# Altium schematic sheet STMwithBut&Leds.SchDoc
size A4; SheetNumber: 1; SheetTotal: 1
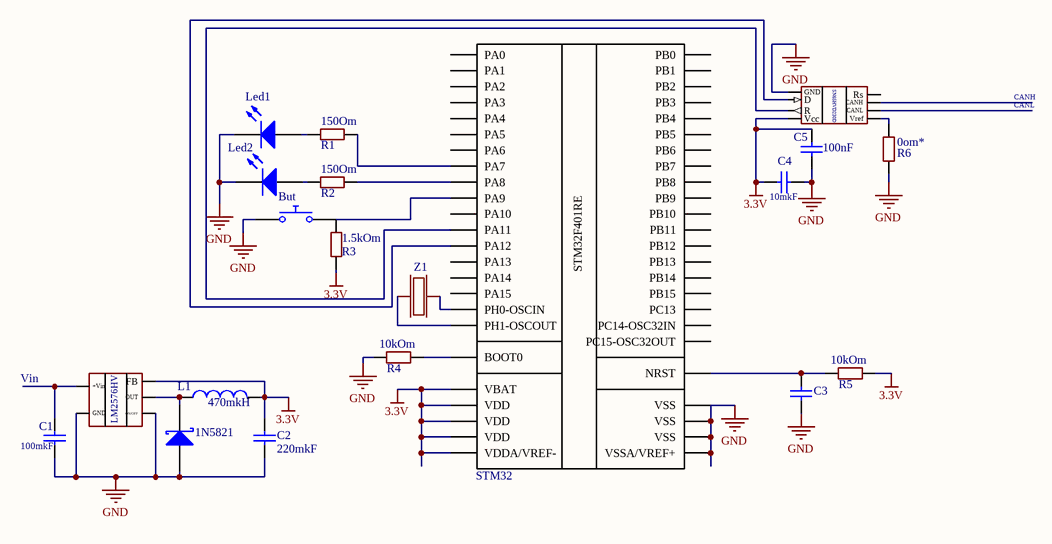
[diagram p0: STMwithBut&Leds.SchDoc]

## Parts
(Parts that share a designator on the sheet are numbered #1, #2 ... from top to bottom, then left to right.)
0om*  R6
1.5kOm  R3
1N5821  Schottky Diode  (value not drawn)
10kOm#1  R4
10kOm#2  R5
10mkF  Capacitor  (value not drawn)
100nF  Capacitor  (value not drawn)
150Om#1  R1
150Om#2  R2
470mkH  Inductor  (value not drawn)
*#1  Component_1  (value not drawn)
*#2  Component_1  (value not drawn)
*#3  STM32
But  Push Button Normally Opened  (value not drawn)
C1  value 100mkF  (hidden comment: Capacitor)
C2  value 220mkF  (hidden comment: Capacitor)
C3  Capacitor  (value not drawn)
Led1  Light-Emitting Diode  (value not drawn)
Led2  Light-Emitting Diode  (value not drawn)
Z1  Кварц  (value not drawn)

## Nets
3.3V: 1.5kOm.8 10kOm#2.9 10mkF.1 100nF.1 470mkH.2 *#1.?3(Vcc) *#2.25(FB) *#3.?20(VBAT) *#3.?21(VDD) *#3.?22(VDD) *#3.?23(VDD) *#3.?24(VDDA/VREF-) C2.2
GND: 0om*.8 1N5821.1(A) 10kOm#1.8 10mkF.2 100nF.2 *#1.21(Rs) *#2.23(ON/OFF) *#2.27(GND) *#3.?45(VSS) *#3.?46(VSS) *#3.?47(VSS) *#3.?48(VSSA/VREF+) But.1 C1.1 C2.1 C3.2 Led1.2(K) Led2.2(K)
Net0om*_9: 0om*.9 *#1.22(Vref)
Net1.5kOm_9: 1.5kOm.9 *#3.?10(PA9) But.2
Net1N5821_2: 1N5821.2(K) 470mkH.1 *#2.24(OUT)
Net10kOm#1_9: 10kOm#1.9 *#3.?19(BOOT0)
Net10kOm#2_8: 10kOm#2.8 *#3.?44(NRST) C3.1
Net150Om#1_8: 150Om#1.8 Led1.1(A)
Net150Om#1_9: 150Om#1.9 *#3.?8(PA7)
Net150Om#2_8: 150Om#2.8 Led2.1(A)
Net150Om#2_9: 150Om#2.9 *#3.?9(PA8)
Net*#1_21: *#1.21(R) *#3.?12(PA11)
Net*#1_?2: *#1.?2(D) *#3.?13(PA12)
Net*#2_26: *#2.26(+Vin) C1.2
Net*#3_?17: *#3.?17(PH0-OSCIN) Z1.?1
Net*#3_?18: *#3.?18(PH1-OSCOUT) Z1.Q?(Кварц)

Not connected (* = marked no-connect by the designer): *#1 ?1(CANH); *#3 ?1(PA0) ?2(PA1) ?3(PA2) ?4(PA3) ?5(PA4) ?6(PA5) ?7(PA6) ?11(PA10) ?14(PA13) ?15(PA14) ?16(PA15) ?25(PB0) ?26(PB1) ?27(PB2) ?28(PB3) ?29(PB4) ?30(PB5) ?31(PB6) ?32(PB7) ?33(PB8) ?34(PB9) ?35(PB10) ?36(PB11) ?37(PB12) ?38(PB13) ?39(PB14) ?40(PB15) ?41(PC13) ?42(PC14-OSC32IN) ?43(PC15-OSC32OUT)

## Notes on the sheet
- C5
- CANH
- CANL
- C4
- Vin
- (near 470mkH) L1
- (in symbol Component_1) STM32F401RE; SN65HVD230D; LM2576HV

## Library data of the parts
0om* 1.5kOm 10kOm#1 10kOm#2 150Om#1 150Om#2 *#3 = Component_1
1N5821 = Schottky Diode: AF: 1; BV: 0; BV_MAX: 1e99; EG: 1.11; FC: 0.5; IBV: 0.001; IS: 1e-14; MJSW: 0.33; NTUN: 30; TNOM: 27; XTI: 3; SimulationGenericComponent: True; CJO: 0; CJP: 0; CTA: 0; CTP: 0; FCS: 0.5; FV_MAX: 1e99; IKF: 0; IKR: 0; ISR: 1e-14; JSW: 0; JTUN: 0; JTUNSW: 0; KEG: 1; KF: 0; LEVEL: 1; N: 1; NBV: 1; NR: 1; NS: 1; PHP: 1; RS: 0; TCV: 0; TLEV: 0; TLEVC: 0; TM1: 0; TM2: 0; TPB: 0; TPHP: 0; TRS: 0; TRS2: 0; TT: 0; TTT1: 0; TTT2: 0; VJ: 1; XTITUN: 3
10mkF 100nF C1-C3 = Capacitor: SimulationGenericComponent: True
470mkH = Inductor: SimulationGenericComponent: True; L1: 1u
But = Push Button NO: closed: 0; Rclosed: 1m; Ropen: 1Meg; SimulationGenericComponent: True
Led1 Led2 = LED: AF: 1; BV: 0; BV_MAX: 1e99; EG: 1.11; FC: 0.5; IBV: 0.001; IS: 1e-14; MJSW: 0.33; NTUN: 30; TNOM: 27; XTI: 3; SimulationGenericComponent: True; CJO: 0; CJP: 0; CTA: 0; CTP: 0; FCS: 0.5; FV_MAX: 1e99; IKF: 0; IKR: 0; ISR: 1e-14; JSW: 0; JTUN: 0; JTUNSW: 0; KEG: 1; KF: 0; LEVEL: 1; N: 1; NBV: 1; NR: 1; NS: 1; PHP: 1; RS: 0; TCV: 0; TLEV: 0; TLEVC: 0; TM1: 0; TM2: 0; TPB: 0; TPHP: 0; TRS: 0; TRS2: 0; TT: 0; TTT1: 0; TTT2: 0; VJ: 1; XTITUN: 3